# EAGLE design EQ_2 (EAGLE 9.2.2)
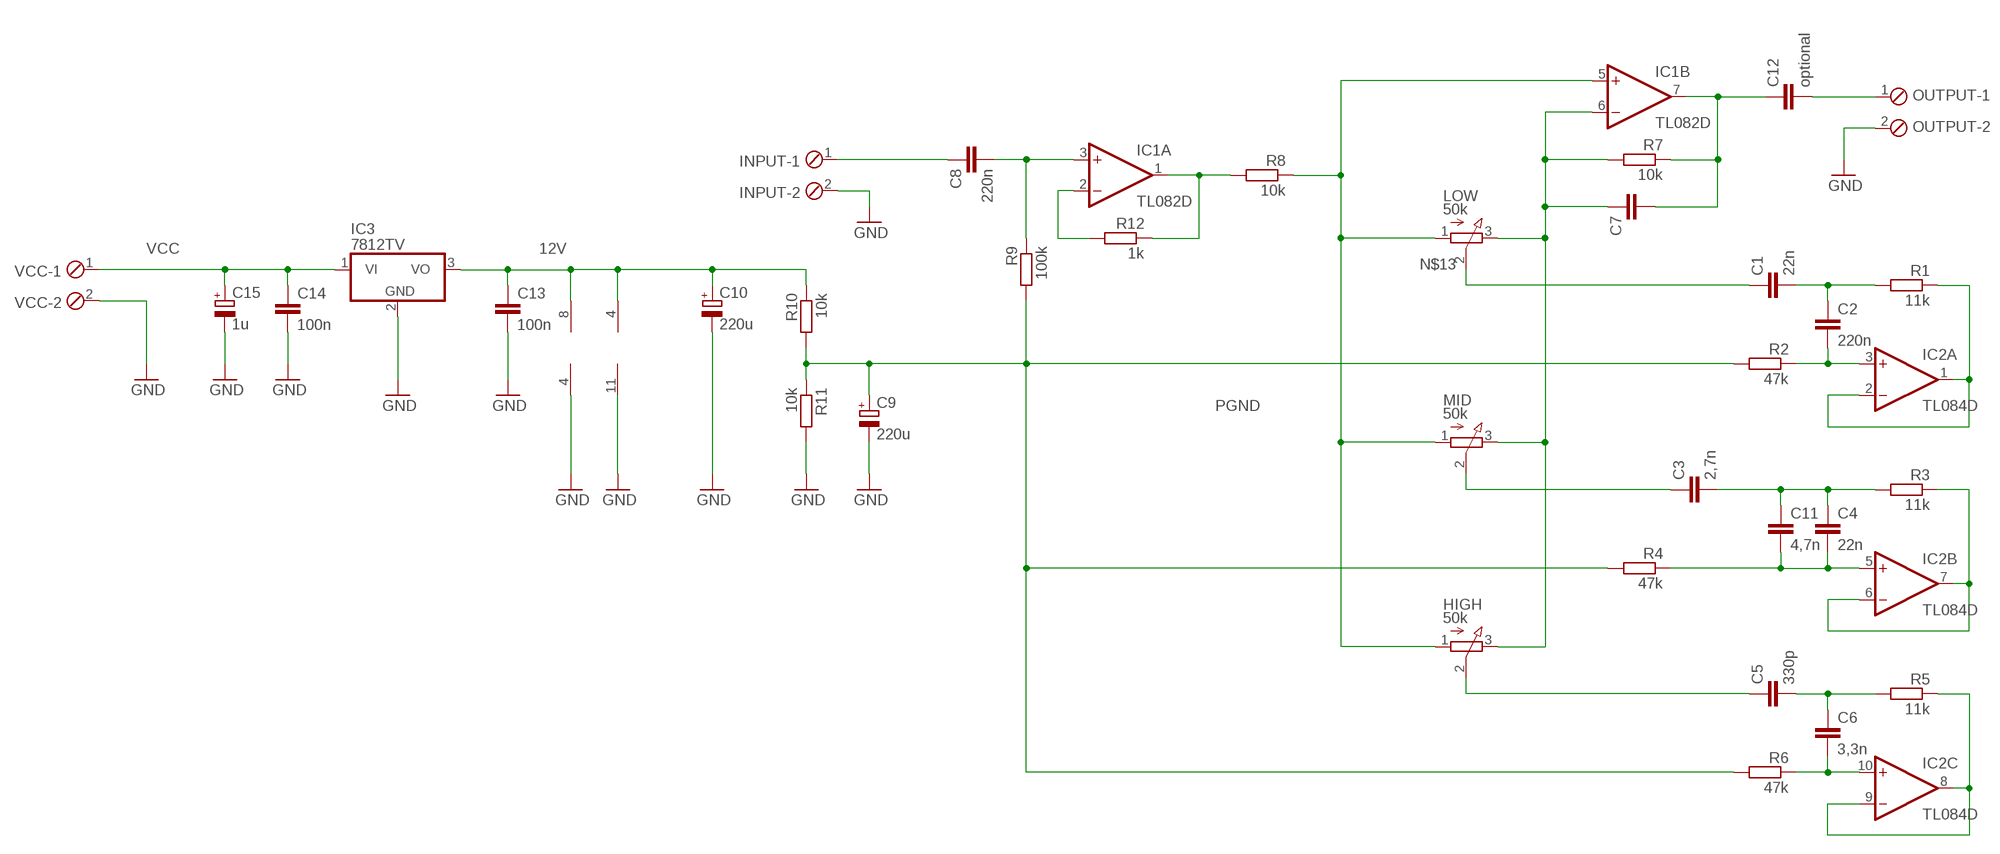
[diagram p0: schematic, sheet 1]

## Parts
C1  22n  C-EUC1206  [C1206]
C2  220n  C-EUC1206  [C1206]
C3  2,7n  C-EUC1206  [C1206]
C4  22n  C-EUC1206  [C1206]
C5  330p  C-EUC1206  [C1206]
C6  3,3n  C-EUC1206  [C1206]
C7  C-EUC1206  [C1206]
C8  220n  C-EUC1206  [C1206]
C9  220u  CPOL-EUE2.5-5  [E2,5-5]
C10  220u  CPOL-EUE2.5-5  [E2,5-5]
C11  4,7n  C-EUC1206  [C1206]
C12  optional  C-EUC1206  [C1206]
C13  100n  C-EUC1206  [C1206]
C14  100n  C-EUC1206  [C1206]
C15  1u  CPOL-EUE2.5-5  [E2,5-5]
HIGH  50k  3RP/1610N  [3RP/1610N]
IC1  TL082D  [SO08]
IC2  TL084D  [SO14]
IC3  7812TV  [TO220V]
INPUT  MPT2  [2POL254]
LOW  50k  3RP/1610N  [3RP/1610N]
MID  50k  3RP/1610N  [3RP/1610N]
OUTPUT  MPT2  [2POL254]
R1  11k  R-EU_R0805  [R0805]
R2  47k  R-EU_R0805  [R0805]
R3  11k  R-EU_R0805  [R0805]
R4  47k  R-EU_R0805  [R0805]
R5  11k  R-EU_R0805  [R0805]
R6  47k  R-EU_R0805  [R0805]
R7  10k  R-EU_R0805  [R0805]
R8  10k  R-EU_R0805  [R0805]
R9  100k  R-EU_R0805  [R0805]
R10  10k  R-EU_R0805  [R0805]
R11  10k  R-EU_R0805  [R0805]
R12  1k  R-EU_R0805  [R0805]
VCC  MPT2  [2POL254]

## Nets
12V: C10.+ C13.1 IC1.8(P:V+) IC2.4(P:V+) IC3.3(VO) R10.1
GND: C9.- C10.- C13.2 C14.2 C15.- IC1.4(P:V-) IC2.11(P:V-) IC3.2(GND) INPUT.2 OUTPUT.2 R11.2 VCC.2
N$1: C2.2 IC2.3(A:+IN) R2.1
N$2: C1.2 C2.1 R1.2
N$3: IC2.1(A:OUT) IC2.2(A:-IN) R1.1
N$4: C3.2 C4.1 C11.1 R3.2
N$5: C4.2 C11.2 IC2.5(B:+IN) R4.1
N$6: IC2.6(B:-IN) IC2.7(B:OUT) R3.1
N$7: C5.2 C6.1 R5.2
N$8: C6.2 IC2.10(C:+IN) R6.1
N$9: IC2.8(C:OUT) IC2.9(C:-IN) R5.1
N$10: C7.2 C12.1 IC1.7(B:OUT) R7.1
N$11: C8.2 IC1.3(A:+IN) R9.1
N$12: C7.1 HIGH.3(E) IC1.6(B:-IN) LOW.3(E) MID.3(E) R7.2
N$13: HIGH.1(A) IC1.5(B:+IN) LOW.1(A) MID.1(A) R8.1
N$14: IC1.1(A:OUT) R8.2 R12.1
N$15: IC1.2(A:-IN) R12.2
N$16: C8.1 INPUT.1
N$18: C5.1 HIGH.2(S)
N$19: C3.1 MID.2(S)
N$20: C1.1 LOW.2(S)
N$22: C12.2 OUTPUT.1
PGND: C9.+ R2.2 R4.2 R6.2 R9.2 R10.2 R11.1
VCC: C14.1 C15.+ IC3.1(VI) VCC.1
Unconnected: IC2.12(D:+IN) IC2.13(D:-IN) IC2.14(D:OUT)

## Library data of the parts
C1-C8 C11-C14 = rcl:C-EU: CAPACITOR, European symbol; SPICEPREFIX: C
C9 C10 C15 = rcl:CPOL-EU: POLARIZED CAPACITOR, European symbol; SPICEPREFIX: C
HIGH LOW MID = pot:3RP/1610N: 16mm Potentiometer one level Source: http://www.alphapotentiometers.net/html/16mm_pot_2.html
IC1 = linear:TL082: OP AMP Data sheet <http://www.ti.com/lit/ds/symlink/tl084a . pdf>; DATA_SHEET: <a href="http://www.ti.com/lit/ds/symlink/tl084a.pdf"> Data sheet </a>
IC2 = linear:TL084: OP AMP
IC3 = linear:78*: Positive VOLTAGE REGULATOR Source: http://cache.national.com/ds/LM/LM78L05.pdf http://www.fairchildsemi.com/ds/LM/LM7805.pdf
INPUT OUTPUT VCC = con-phoenix-254:MPT2: PHOENIX CONNECTOR; OC_FARNELL: unknown; OC_NEWARK: unknown
R1-R12 = rcl:R-EU_: RESISTOR, European symbol; SPICEPREFIX: R

## Board
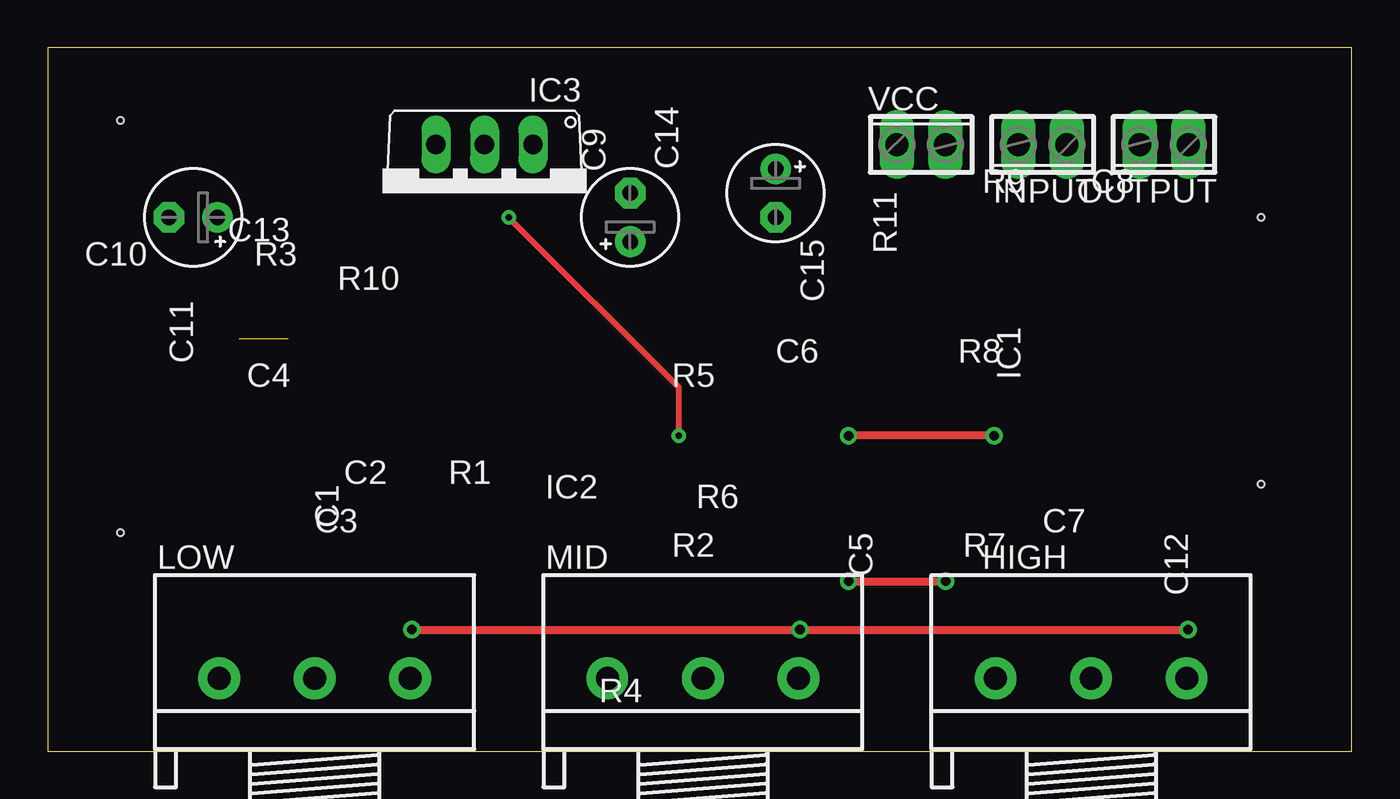
[diagram p1: board, top side]
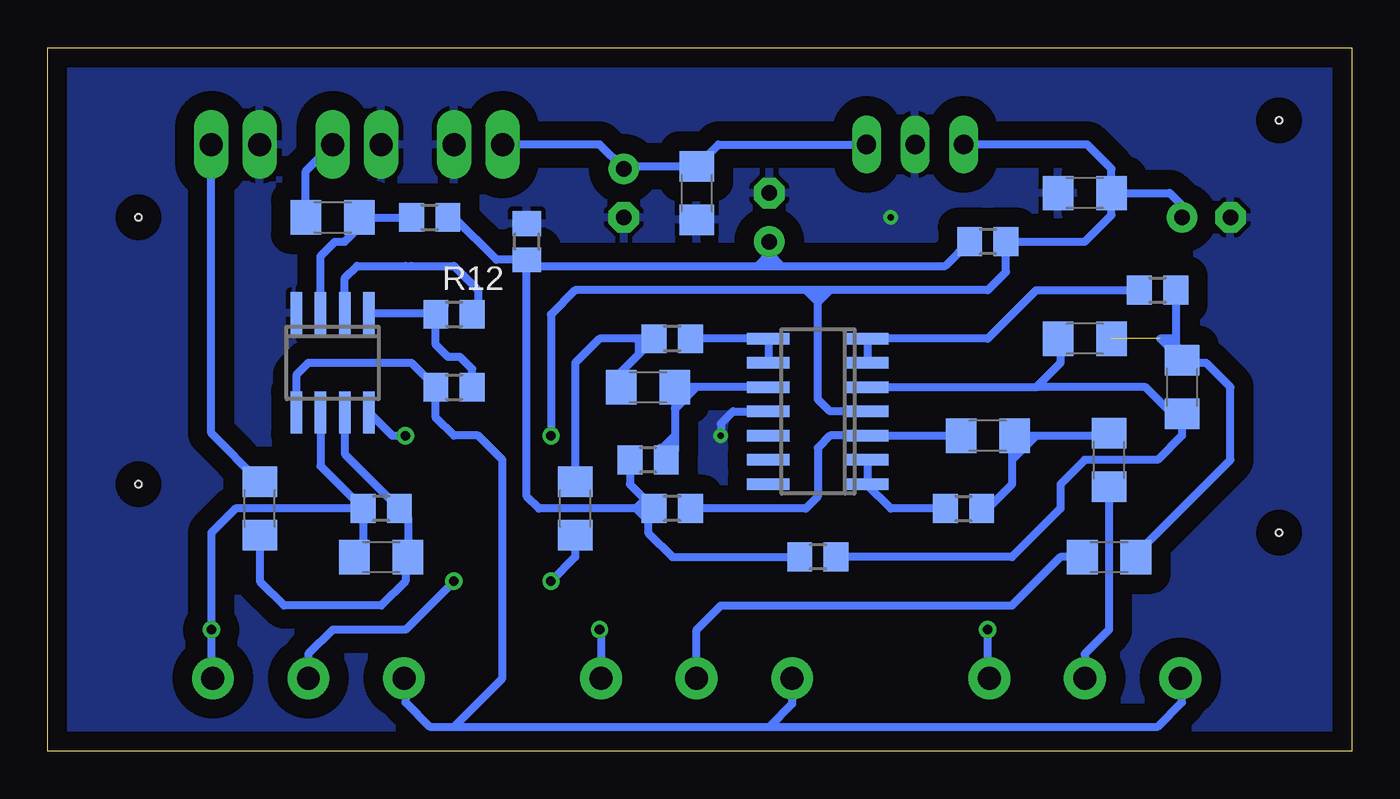
[diagram p2: board, bottom side, seen from below]

Size 68.25 x 36.82 mm. Coordinates in mm from the lower left corner, seen from the top.
Outline: 0,0 68.25,0 68.25,36.82 0,36.82 0,0
Copper layers (1*16): Top 0.035mm / dielectric 1.5mm / Bottom 0.035mm
Design rules "default": minimum track width 6mil, minimum drill 0.35mm, track to track 6mil, track to pad 6mil, pad to pad 6mil, via to via 6mil, smd to smd 6mil, copper to edge 40mil, drill to drill 6mil, minimum pad ring 10mil, minimum via ring 8mil, stop-mask expansion 4mil, vias tented up to drill 0mil, thermal gap 10mil
Holes 0.35 mm at 3.81,33.02 63.5,27.94 63.5,13.97 3.81,11.43

### Footprints (pad centres in the part's own frame; a part is rotated, then mirrored left to right if it is on the bottom)
C1206 = smd 1.6 x 1.8: 1 -1.4,0; 2 1.4,0
E2,5-5 = drill 0.813 pad 1.6: + -1.27,0 | drill 0.813 pad 1.6 octagon: - 1.27,0
3RP/1610N = drill 1.2 pad 2.184: 1 -5,0; 2 0,0; 3 5,0
SO08 = smd 0.6 x 2.2: 1 -1.905,-2.6; 2 -0.635,-2.6; 3 0.635,-2.6; 4 1.905,-2.6; 5 1.905,2.6; 6 0.635,2.6; 7 -0.635,2.6; 8 -1.905,2.6
SO14 = smd 0.6 x 2.2: 1 -3.81,-2.6; 2 -2.54,-2.6; 3 -1.27,-2.6; 4 0,-2.6; 5 1.27,-2.6; 6 2.54,-2.6; 7 3.81,-2.6; 8 3.81,2.6; 9 2.54,2.6; 10 1.27,2.6; 11 0,2.6; 12 -1.27,2.6; 13 -2.54,2.6; 14 -3.81,2.6
TO220V = drill 1.016 long: 1 -2.54,-2.54; 2 0,-2.54; 3 2.54,-2.54
2POL254 = drill 1.2 long: 1 -1.27,0; 2 1.27,0
R0805 = smd 1.3 x 1.5: 1 -0.95,0; 2 0.95,0

### Placement (x,y rotation side)
C1  12.7,15.24 90 bottom
C2  19.05,16.51 180 bottom
C3  12.7,10.16 0 bottom
C4  13.97,21.59 180 bottom
C5  40.64,12.7 90 bottom
C6  36.83,19.05 0 bottom
C7  50.8,10.16 0 bottom
C8  53.34,27.94 0 bottom
C9  30.48,27.94 90 top
C10  7.62,27.94 180 top
C11  8.89,19.05 270 bottom
C12  57.15,12.7 90 bottom
C13  13.97,29.21 180 bottom
C14  34.29,29.21 270 bottom
C15  38.1,29.21 270 top
HIGH  54.61,3.81 0 top
IC1  53.34,20.32 180 bottom
IC2  27.94,17.78 90 bottom
IC3  22.86,29.21 180 top
INPUT  52.07,31.75 180 top
LOW  13.97,3.81 0 top
MID  34.29,3.81 0 top
OUTPUT  58.42,31.75 180 top
R1  20.32,12.7 0 bottom
R2  35.56,12.7 180 bottom
R3  10.16,24.13 0 bottom
R4  27.94,10.16 180 bottom
R5  35.56,21.59 180 bottom
R6  36.83,15.24 180 bottom
R7  50.8,12.7 180 bottom
R8  46.99,19.05 0 bottom
R9  48.26,27.94 0 bottom
R10  19.05,26.67 180 bottom
R11  43.18,26.67 90 bottom
R12  46.99,22.86 0 bottom
VCC  45.72,31.75 0 top

### Tracks (layer width: path | path; a pad name or v marks a point on that pad's centre or on a via)
12V  (via drill 0.5)
  Top 0.406: v49.53,16.51 v41.91,16.51
  Bottom 0.406: 27.31,24.13 19.05,24.13 18.1,25.08 R10.1 | 27.31,24.13 27.94,24.13 | 27.94,24.13 28.57,24.13 | 28.57,24.13 40.64,24.13 41.91,22.86 v41.91,16.51 | 17.78,26.99 R10.1 | 17.78,26.67 R10.1 | C13.1 12.57,30.48 13.84,31.75 IC3.3 | R10.1 13.97,26.67 12.57,28.07 C13.1 | v49.53,16.51 50.22,16.51 IC1.8 | IC2.4 27.31,17.78 27.94,18.41 27.94,23.5 | C10.+ 8.89,28.57 9.53,29.21 C13.1 | 27.94,23.5 27.94,24.13 | 27.94,23.5 28.57,24.13 | 27.94,23.5 27.31,24.13
GND  (via drill 0.35)
  Top 0.305: v24.13,27.94 33.02,19.05 v33.02,16.51
  Bottom 0.305: 31.11,17.78 IC2.11
  Bottom 0.406: v33.02,16.51 33.02,17.14 32.39,17.78 31.11,17.78
  pour Bottom (isolate 1.016): -2.54,36.83 -2.54,1.27 -1.27,0 73.66,0 73.66,35.56 71.12,38.1 -1.27,38.1
N$1
  Bottom 0.406: C2.2 IC2.3 27.31,16.51 27.94,15.88 27.94,13.34 28.57,12.7 R2.1
N$2
  Bottom 0.406: 18.92,12.25 19.21,12.54 | 19.21,12.54 R1.2 | 19.21,12.54 17.78,13.97 17.78,15.24 | C1.2 12.83,16.51 16.51,16.51 | 16.51,16.51 C2.1 arc-90 17.78,16.38 17.78,15.24 | 16.51,16.51 17.78,15.24
N$3
  Bottom 0.406: IC2.2 IC2.1 25.37,13.94 | 25.37,13.94 25.4,13.91 | R1.1 24.13,12.7 25.37,13.94
N$4  (1 unrouted)
  Bottom 0.406: 13.02,21.59 C4.1 | C11.1 10.03,21.59 9.53,21.59 | R3.2 9.21,21.59 | 9.21,21.59 9.21,20.77 C11.1 | C11.1 8.76,20.32 7.62,20.32 6.35,19.05 6.35,15.24 11.3,10.29 C3.2 | 9.21,21.59 9.53,21.59 | C11.1 8.89,20.95 9.53,21.59
N$5
  Bottom 0.406: R4.1 17.78,10.16 15.24,12.7 15.24,13.97 13.97,15.24 10.16,15.24 8.89,16.51 C11.2 9.39,17.65 10.8,19.05 16.51,19.05 | IC2.5 16.51,19.05 | C4.2 15.24,21.46 15.24,20.32 16.51,19.05
N$6
  Bottom 0.406: IC2.6 IC2.7 19.05,21.59 16.51,24.13 R3.1
N$7
  Bottom 0.406: 37.47,21.59 R5.2 37.31,20.8 | 37.47,21.59 39.37,21.59 40.64,20.32 C5.2 | 37.31,20.8 38.23,19.87 C6.1 | 37.31,20.8 37.31,21.43 37.47,21.59
N$8
  Bottom 0.406: IC2.10 34.29,19.05 | 34.29,19.05 C6.2 35.43,17.91 | 35.43,17.91 35.43,16.51 | 35.43,16.51 35.43,15.69 R6.1 | 34.29,19.05 35.43,17.91 | 35.43,16.51 36.06,15.88 36.2,15.88
N$9
  Bottom 0.406: R5.1 IC2.8 IC2.9
N$10
  Bottom 0.406: IC1.7 52.7,15.55 R7.1 49.4,12.25 C7.2 49.53,10.03 49.53,8.89 50.8,7.62 55.88,7.62 57.15,8.89 C12.1
N$11
  Bottom 0.406: 49.66,27.94 R9.1 51.44,27.94 | 51.44,27.94 C8.2 52.32,27.56 52.32,27.05 | IC1.3 53.97,25.91 53.21,26.67 52.7,26.67 52.32,27.05 | 52.32,27.05 51.44,27.94
N$12  (via drill 0.5)
  Top 0.406: v19.05,6.35 v39.37,6.35 v59.69,6.35
  Bottom 0.406: IC1.6 53.97,14.93 R7.2 | R7.2 51.75,10.61 C7.1 | R7.2 58.42,12.7 59.69,11.43 v59.69,6.35 59.69,3.89 HIGH.3 | LOW.3 19.05,3.89 v19.05,6.35 | v39.37,6.35 39.29,6.27 MID.3
N$13
  Bottom 0.406: LOW.1 8.89,3.89 8.89,2.54 10.16,1.27 30.48,1.27 | HIGH.1 49.53,3.73 49.53,2.54 48.26,1.27 46.99,1.27 | 46.99,1.27 30.48,1.27 | MID.1 29.29,2.46 30.48,1.27 | R8.1 48.26,19.05 | 46.99,1.27 44.45,3.81 44.45,15.24 45.72,16.51 46.99,16.51 47.94,17.46 R8.1 | IC1.5 55.24,19.68 54.61,20.32 49.21,20.32 R8.1
N$14
  Bottom 0.406: 47.47,23.34 R12.1 | IC1.1 48,22.92 R12.1 | R12.1 47.94,21.27 47.31,20.64 46.67,20.64 46.04,20 R8.2
N$15
  Bottom 0.406: IC1.2 52.7,24.77 52.07,25.4 49.53,25.4 49.21,25.4 46.99,25.4 45.72,24.13 45.72,23.18 R12.2
N$16
  Bottom 0.406: C8.1 54.74,30.35 INPUT.1
N$18  (via drill 0.5)
  Top 0.406: v41.91,8.89 v46.99,8.89
  Bottom 0.406: C5.1 40.64,10.16 v41.91,8.89 | v46.99,8.89 49.53,6.35 53.34,6.35 54.61,5.08 HIGH.2
N$19
  Bottom 0.406: MID.2 34.29,6.35 33.02,7.62 17.78,7.62 15.24,10.16 C3.1
N$20
  Bottom 0.406: 12.83,13.84 C1.1 12.7,6.35 13.97,5.08 LOW.2
N$22
  Bottom 0.406: OUTPUT.1 59.69,16.64 C12.2
PGND
  Bottom 0.406: R9.2 46.99,27.94 44.77,25.72 R11.1 | R10.2 21.27,25.4 29.85,25.4 | R6.2 37.78,13.97 36.99,13.18 | 36.99,13.18 R2.2 | R2.2 36.83,12.38 36.83,12.06 | 36.83,12.06 36.83,11.43 35.56,10.16 R4.2 | R11.1 42.86,25.4 31.11,25.4 | 31.11,25.4 30.48,25.4 | 30.48,25.4 29.85,25.4 | 30.48,26.04 29.85,25.4 | 30.48,26.04 C9.+ 30.48,25.4 | 30.48,26.04 31.11,25.4 | R2.2 37.47,12.7 | 37.47,12.7 42.55,12.7 43.18,13.34 R11.1 | 37.47,12.7 36.83,12.06 | 37.47,12.7 36.99,13.18
VCC
  Bottom 0.406: VCC.1 39.37,31.75 C15.+ 37.97,30.61 C14.1 33.15,31.75 IC3.1